# Altium schematic sheet Footpedal-Wiring.SchDoc
size A
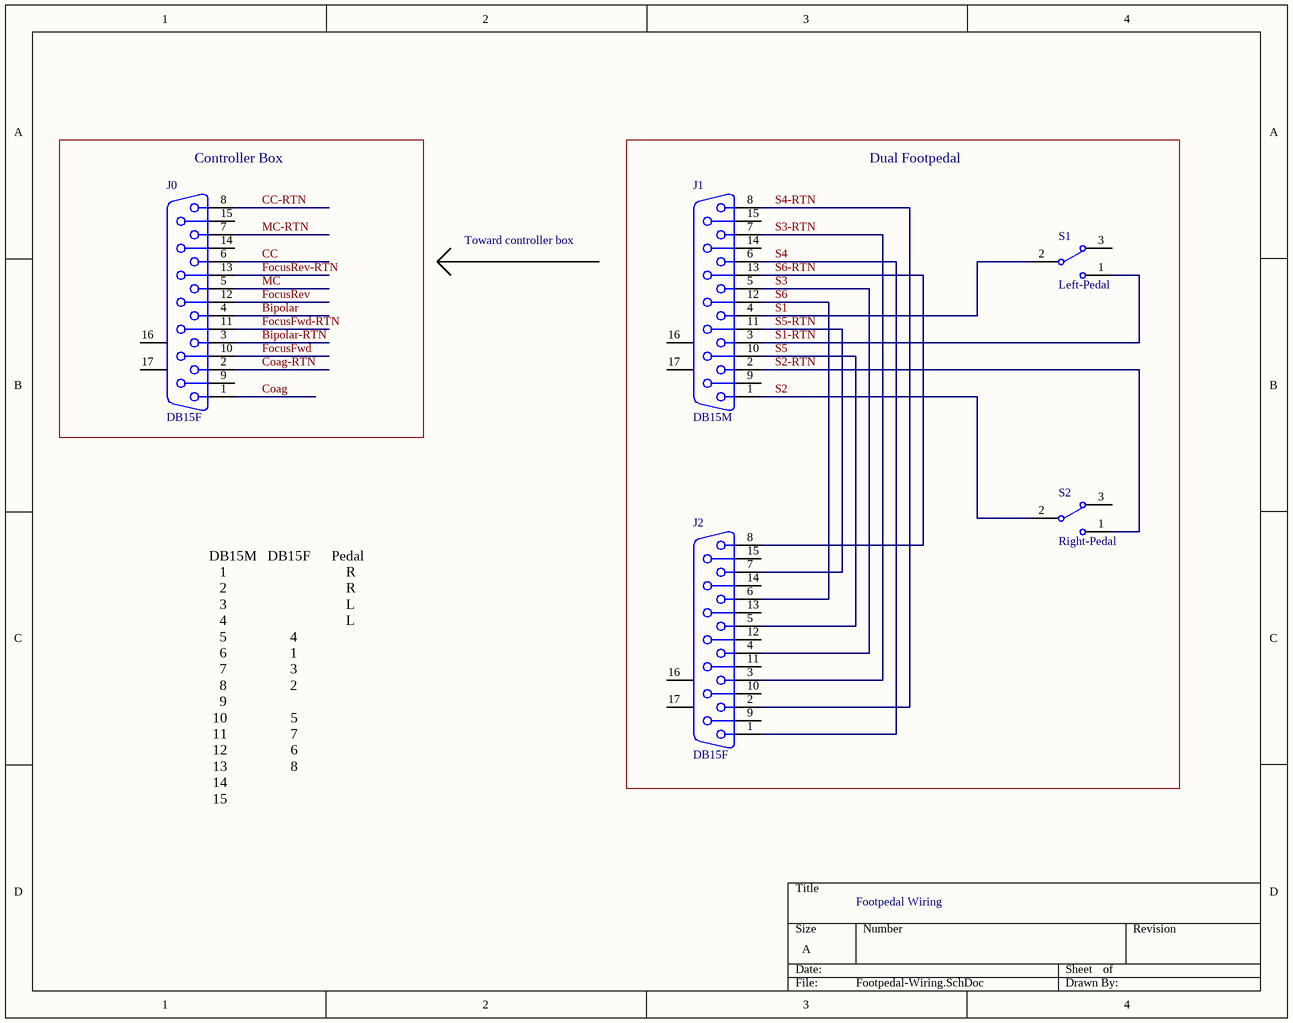
[diagram p0: Footpedal-Wiring.SchDoc]

## Parts
J0  DB15F  [DSUB1.385-2H15]
J1  DB15M  [DSUB1.385-2H15]
J2  DB15F  [DSUB1.385-2H15]
S1  Left-Pedal  [TL36WW15050]
S2  Right-Pedal  [TL36WW15050]

## Blocks framed on the sheet
Controller Box: J0
Dual Footpedal: J1 J2 S1 S2

## Nets
Bipolar: J0.4
Bipolar-RTN: J0.3
CC: J0.6
CC-RTN: J0.8
Coag: J0.1
Coag-RTN: J0.2
FocusFwd: J0.10
FocusFwd-RTN: J0.11
FocusRev: J0.12
FocusRev-RTN: J0.13
MC: J0.5
MC-RTN: J0.7
S1: J1.4 S1.2
S1-RTN: J1.3 S1.1
S2: J1.1 S2.2
S2-RTN: J1.2 S2.1
S3: J1.5 J2.4
S3-RTN: J1.7 J2.3
S4: J1.6 J2.1
S4-RTN: J1.8 J2.2
S5: J1.10 J2.5
S5-RTN: J1.11 J2.7
S6: J1.12 J2.6
S6-RTN: J1.13 J2.8

Not connected (* = marked no-connect by the designer): J0 9 14 15 16(MH1) 17(MH2); J1 9 14 15 16(MH1) 17(MH2); J2 9 10 11 12 13 14 15 16(MH1) 17(MH2); S1 3; S2 3

## Notes on the sheet
- Toward controller box
- DB15M   DB15F      Pedal
  1                                  R
  2                                  R
  3                                  L
  4                                  L
  5                  4
  6                  1
  7                  3
  8                  2
  9
  10                  5
  11                  7
  12                  6
  13                  8
  14
  15
- Footpedal Wiring

## Library data of the parts
J0-J2 = D Connector 15: Receptacle Assembly, 15 Position, Right Angle; PackageDocument: O; Positions: 15; Published: 15-Jun-2001; LatestRevisionDate: 17-Jul-2002; LatestRevisionNote: Re-released for DXP Platform.; DatasheetDocument: 1-Sep-99; PackageReference: 788757; Publisher: Altium Limited; Orientation: Right Angle; Gender: Receptacle
S1 S2 = SW-SPDT: SPDT Subminiature Toggle Switch, Right Angle Mounting, Vertical Actuation; Published: 24-Mar-1999; LatestRevisionDate: 17-Dec-2003; LatestRevisionNote: Schematic revised, PCB Footprint replaced.; DatasheetVersion: 05-Dec-2000; PackageReference: TL36WW15050; Publisher: Altium Limited; PackageDescription: Switch; 4 Leads; ComponentLink1Description: Manufacturer Link; ComponentLink1URL: http://www.apem.com